# EAGLE schematic Z-_SUN_REV_B (EAGLE 9.6.2)
DESIGNER: Thomas Christison; REV#: B; REVIEWER: ADCS Electrical

## Sheet 1 of 6
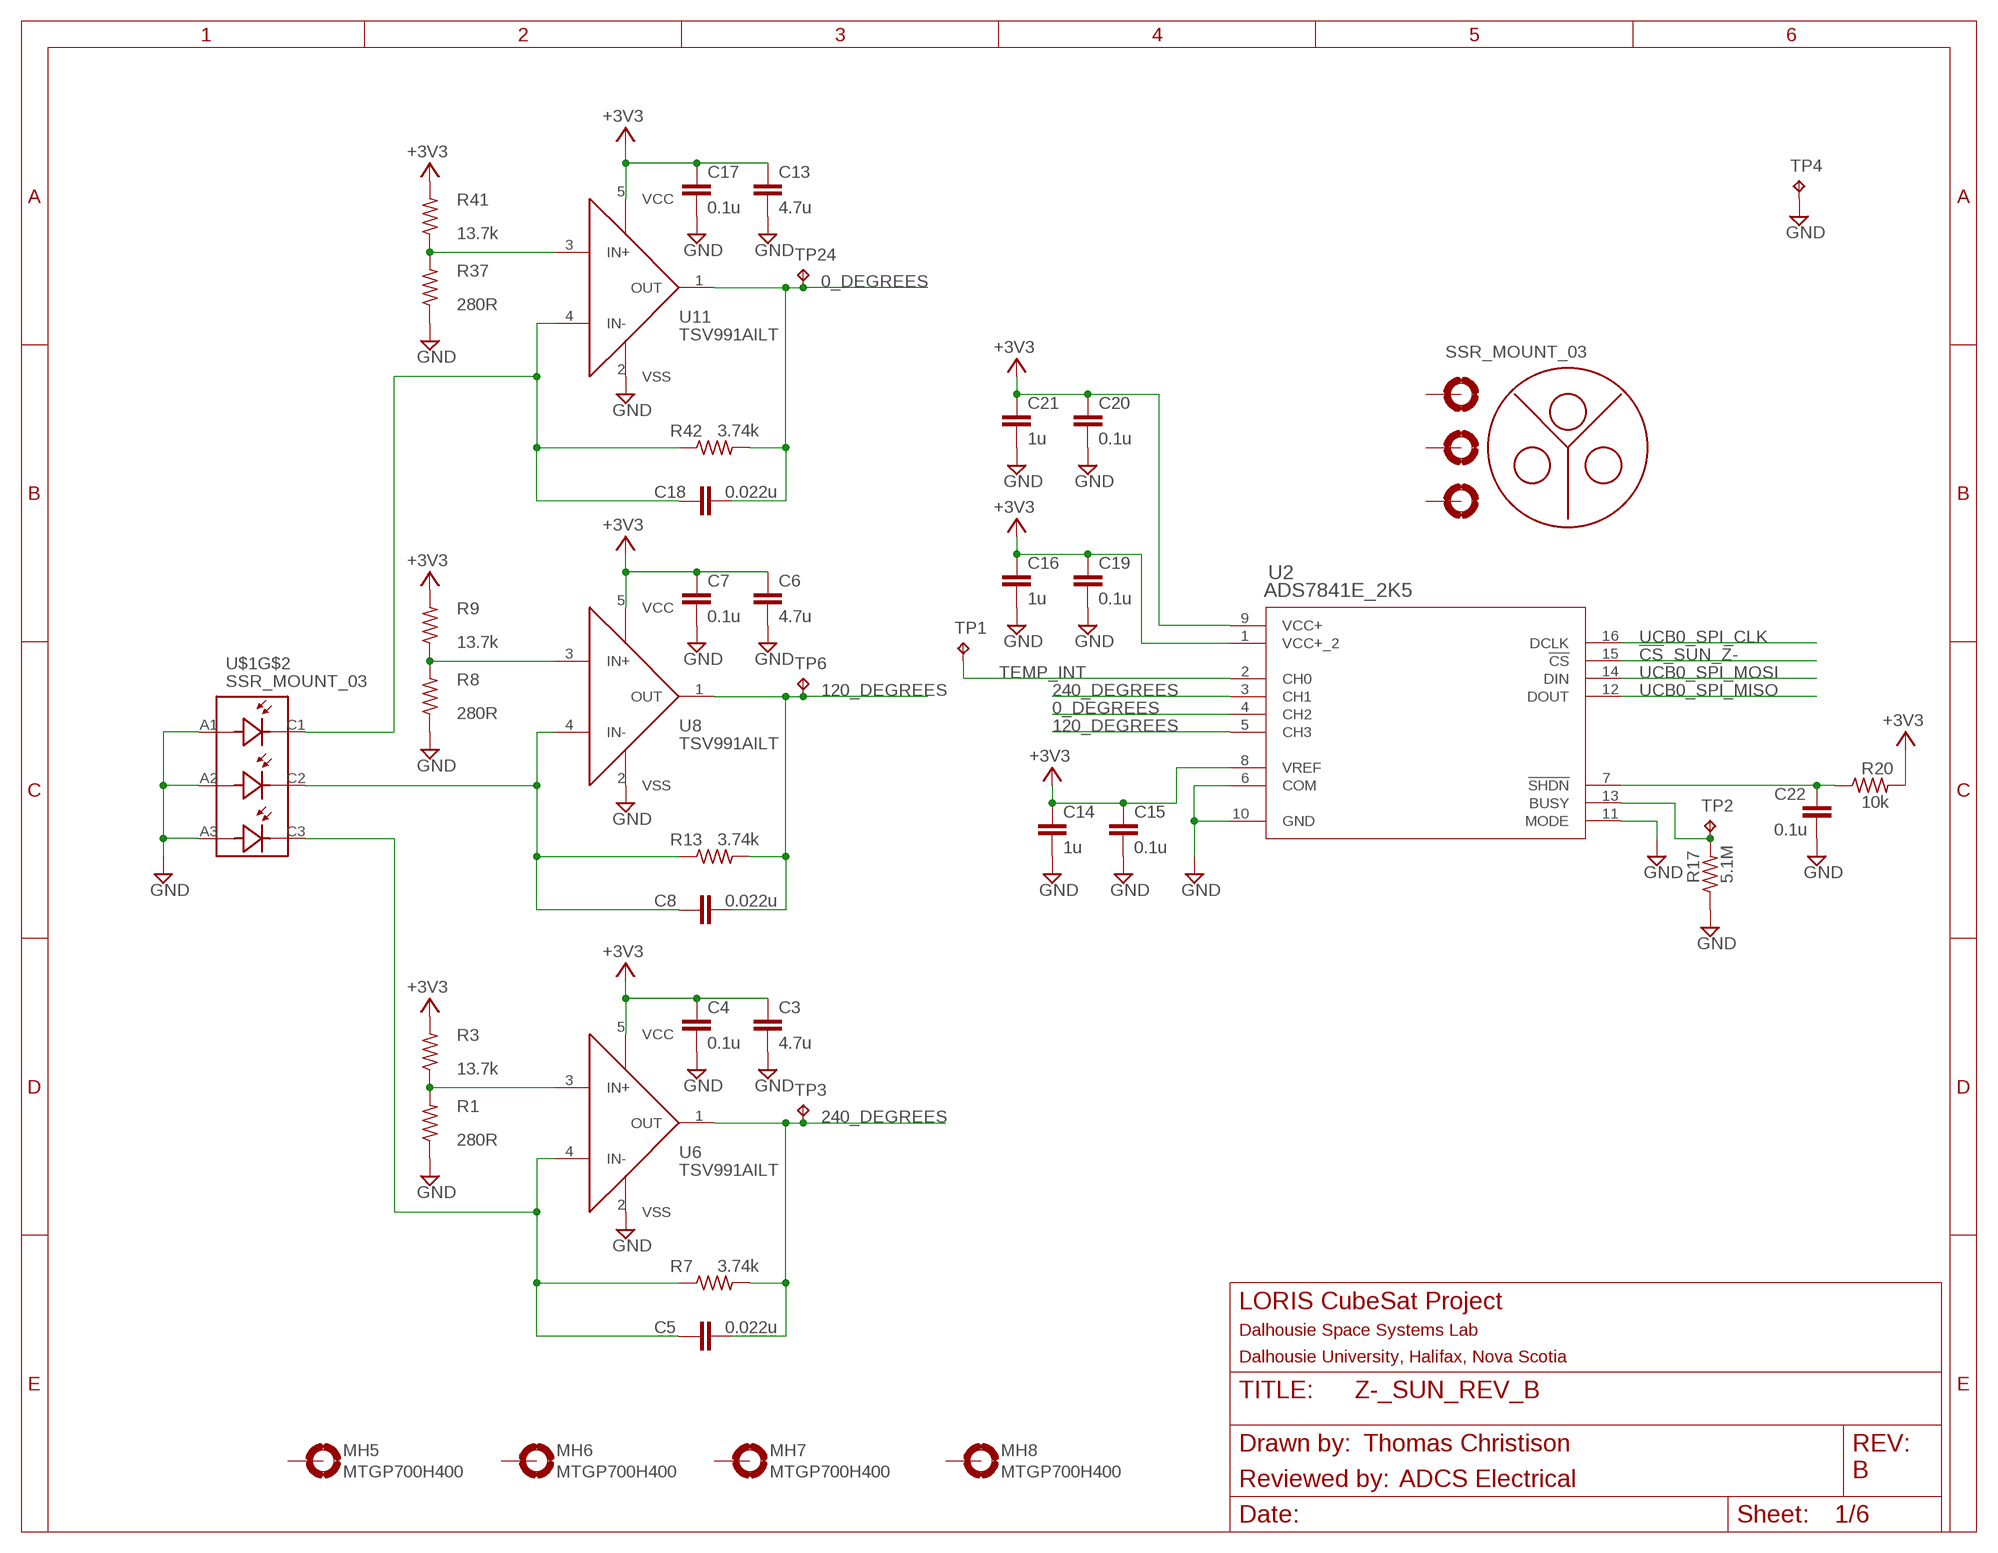
[diagram p0: schematic, sheet 1]

### Parts
C3  4.7u  C-EUC0805  [C0805]
C4  0.1u  C-EUC0402  [C0402]
C5  0.022u  C-EUC0402  [C0402]
C6  4.7u  C-EUC0805  [C0805]
C7  0.1u  C-EUC0402  [C0402]
C8  0.022u  C-EUC0402  [C0402]
C13  4.7u  C-EUC0805  [C0805]
C14  1u  C-EUC0402  [C0402]
C15  0.1u  C-EUC0402  [C0402]
C16  1u  C-EUC0402  [C0402]
C17  0.1u  C-EUC0402  [C0402]
C18  0.022u  C-EUC0402  [C0402]
C19  0.1u  C-EUC0402  [C0402]
C20  0.1u  C-EUC0402  [C0402]
C21  1u  C-EUC0402  [C0402]
C22  0.1u  C-EUC0402  [C0402]
MH5  MTGP700H400  [MTGP700H400]
MH6  MTGP700H400  [MTGP700H400]
MH7  MTGP700H400  [MTGP700H400]
MH8  MTGP700H400  [MTGP700H400]
R1  280R  R-US_R0402  [R0402]
R3  13.7k  R-US_R0402  [R0402]
R7  3.74k  R-US_R0402  [R0402]
R8  280R  R-US_R0402  [R0402]
R9  13.7k  R-US_R0402  [R0402]
R13  3.74k  R-US_R0402  [R0402]
R17  5.1M  R-US_R0402  [R0402]
R20  10k  R-US_R0402  [R0402]
R37  280R  R-US_R0402  [R0402]
R41  13.7k  R-US_R0402  [R0402]
R42  3.74k  R-US_R0402  [R0402]
TP1  TESTPOINT  [TP_P76H50]
TP2  TESTPOINT  [TP_P76H50]
TP3  TESTPOINT  [TP_P76H50]
TP4  TESTPOINT  [TP_P76H50]
TP6  TESTPOINT  [TP_P76H50]
TP24  TESTPOINT  [TP_P76H50]
U2  ADS7841E_2K5  [DBQ16]
U6  TSV991AILT  [SOT95P280X145-5N]
U8  TSV991AILT  [SOT95P280X145-5N]
U11  TSV991AILT  [SOT95P280X145-5N]
U$1  SSR_MOUNT_03  [SSR_MOUNT_03]

### Nets
0_DEGREES: C18.2 R42.2 TP24.1(TP) U2.4(CH2) U11.1(OUT)
120_DEGREES: C8.2 R13.2 TP6.1(TP) U2.5(CH3) U8.1(OUT)
240_DEGREES: C5.2 R7.2 TP3.1(TP) U2.3(CH1) U6.1(OUT)
!CS!_SUN_Z-: U2.15(!CS) ; also sheet 2
+3V3: C3.1 C4.1 C6.1 C7.1 C13.1 C14.1 C15.1 C16.1 C17.1 C19.1 C20.1 C21.1 R3.2 R9.2 R20.2 R41.2 U2.1(VCC+_2) U2.8(VREF) U2.9(VCC+) U6.5(VCC) U8.5(VCC) U11.5(VCC) ; also sheet 2,3,4,5,6
GND: C3.2 C4.2 C6.2 C7.2 C13.2 C14.2 C15.2 C16.2 C17.2 C19.2 C20.2 C21.2 C22.2 R1.1 R8.1 R17.1 R37.1 TP4.1(TP) U2.6(COM) U2.10(GND) U2.11(MODE) U6.2(VSS) U8.2(VSS) U11.2(VSS) U$1.A1 U$1.A2 U$1.A3 ; also sheet 2,3,4,5,6
N$2: R17.2 TP2.1(TP) U2.13(BUSY)
N$8: R1.2 R3.1 U6.3(IN+)
N$12: C5.1 R7.1 U6.4(IN-) U$1.C3
N$15: C22.1 R20.1 U2.7(!SHDN)
N$27: C8.1 R13.1 U8.4(IN-) U$1.C2
N$28: R8.2 R9.1 U8.3(IN+)
N$42: C18.1 R42.1 U11.4(IN-) U$1.C1
N$43: R37.2 R41.1 U11.3(IN+)
TEMP_INT: TP1.1(TP) U2.2(CH0) ; also sheet 2
UCB0_SPI_CLK: U2.16(DCLK) ; also sheet 2,3,4,5,6
UCB0_SPI_MISO: U2.12(DOUT) ; also sheet 2,3,4,5,6
UCB0_SPI_MOSI: U2.14(DIN) ; also sheet 2,3,4,5,6
Unconnected: MH5.1(MOUNT) MH6.1(MOUNT) MH7.1(MOUNT) MH8.1(MOUNT) U$1.1(MOUNT) U$1.2(MOUNT1) U$1.3(MOUNT2)

### Notes on the sheet
- Thomas Christison
- B
- ADCS Electrical

## Sheet 2 of 6
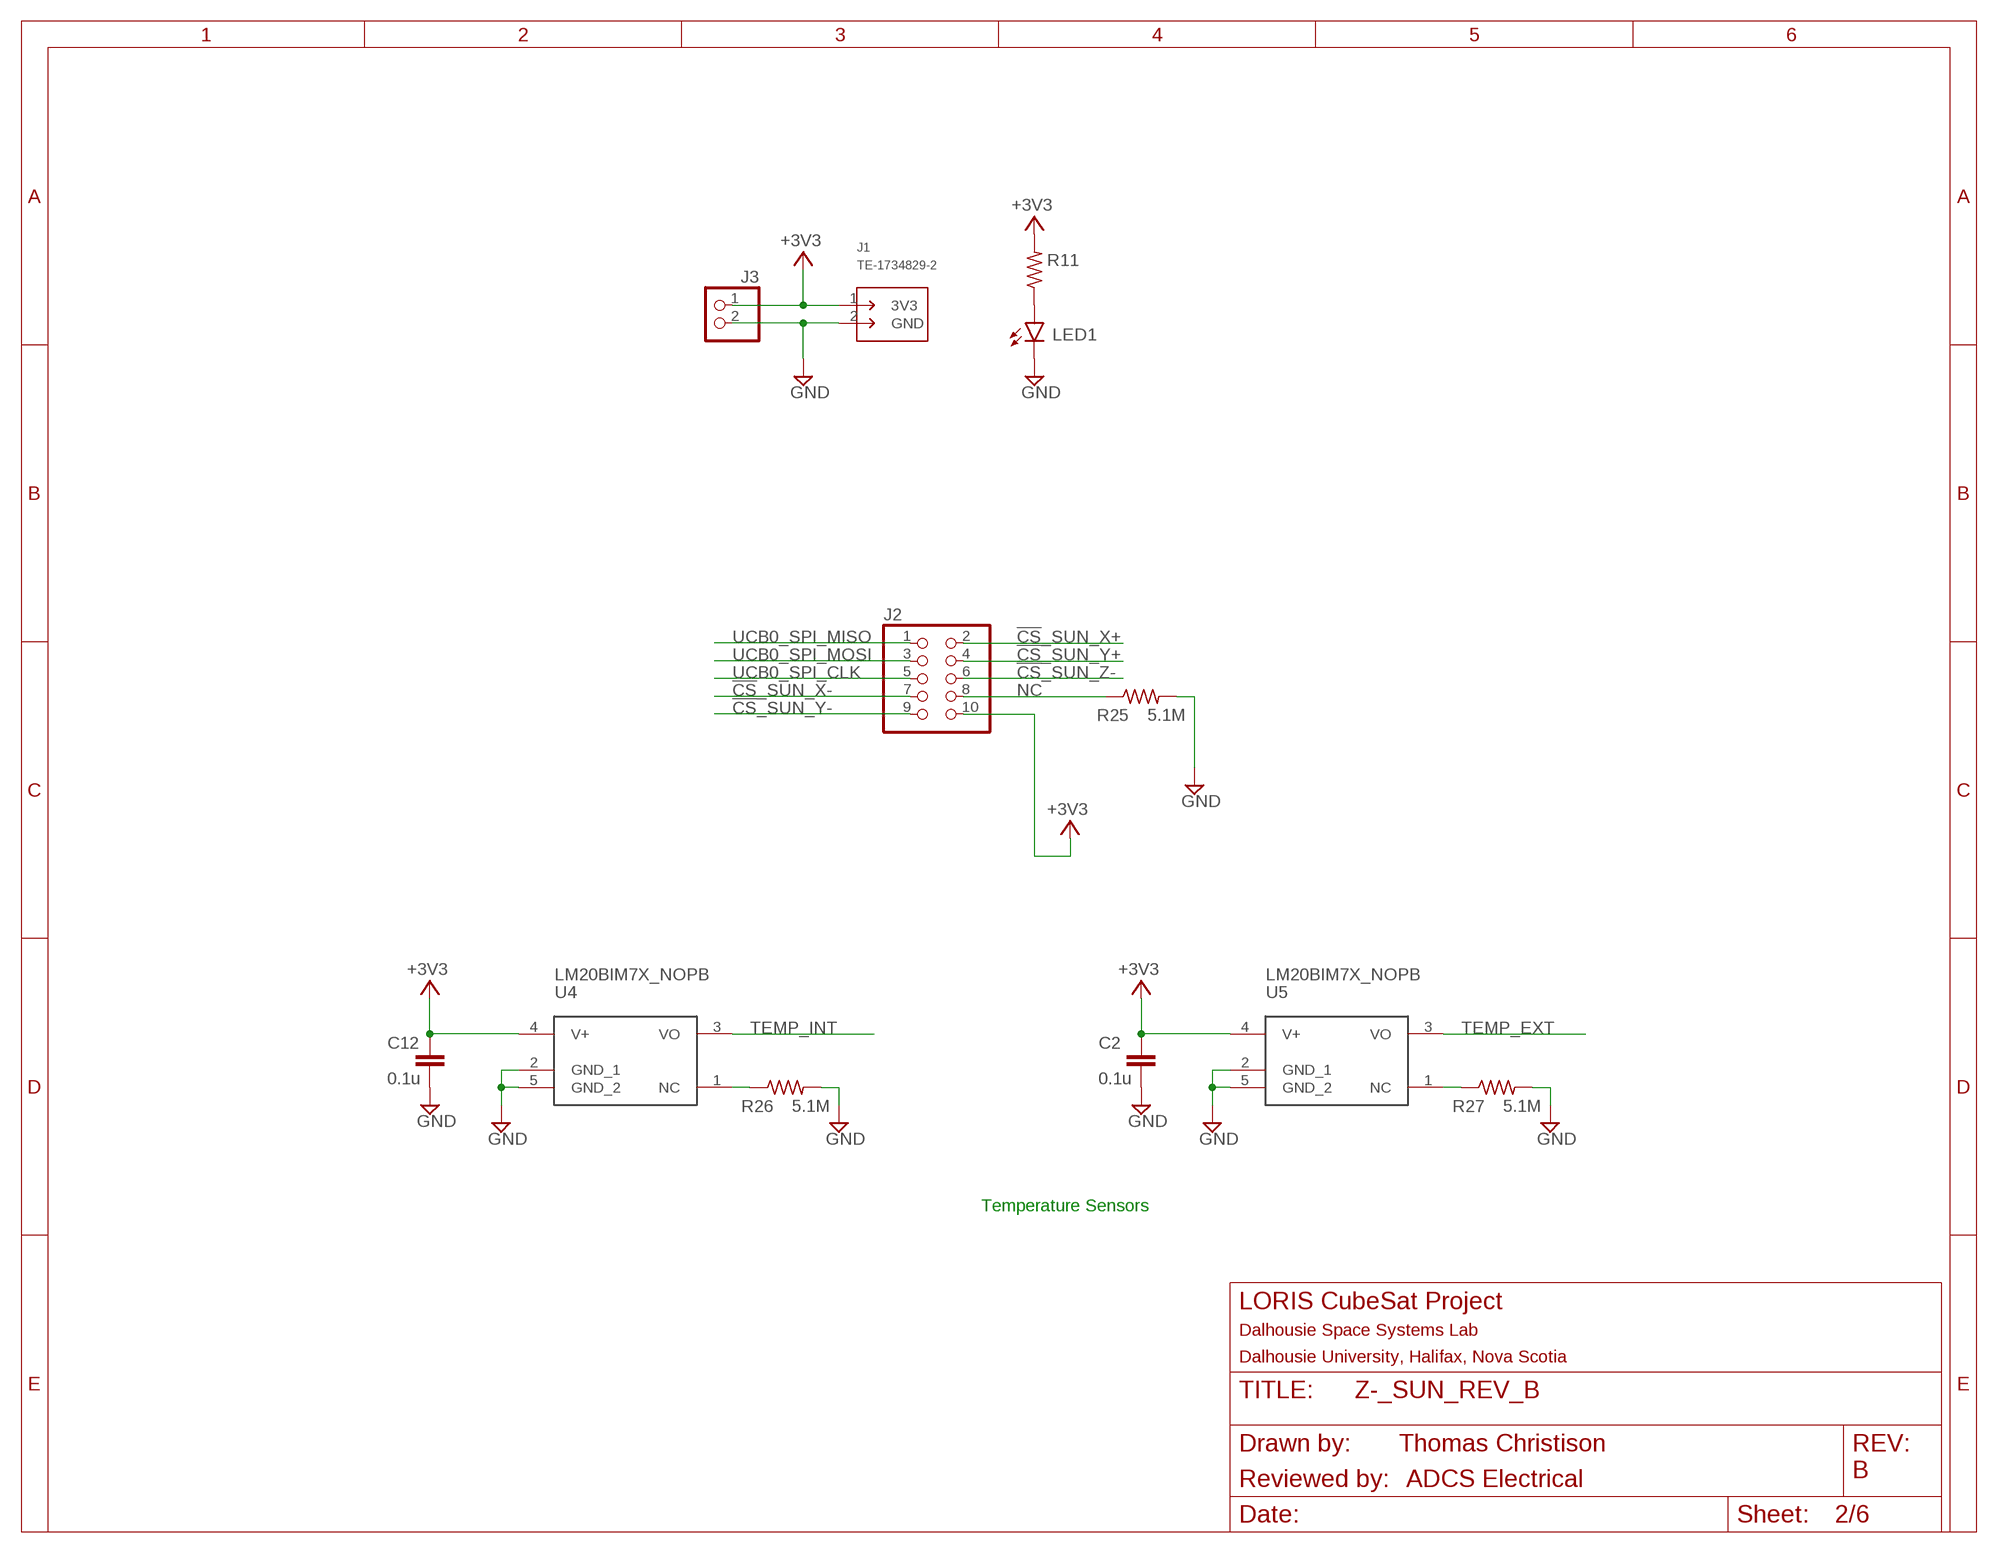
[diagram p1: schematic, sheet 2]

### Parts
C2  0.1u  C-EUC0402  [C0402]
C12  0.1u  C-EUC0402  [C0402]
J1  TE-1734829-2  [TE-1734829-2]
J2  PINHD-2X5_MTG_HOLES  [2X05]
J3  HDR_1X2_  [1X02]
LED1  LEDCHIP-LED0603  [CHIP-LED0603]
R11  R-US_R0603  [R0603]
R25  5.1M  R-US_R0402  [R0402]
R26  5.1M  R-US_R0402  [R0402]
R27  5.1M  R-US_R0402  [R0402]
U4  LM20BIM7X_NOPB  [SOT23-5P65_210X110L40X22N_LM20]
U5  LM20BIM7X_NOPB  [SOT23-5P65_210X110L40X22N_LM20]

### Nets
!CS!_SUN_X+: J2.2 ; also sheet 3
!CS!_SUN_X-: J2.7 ; also sheet 4
!CS!_SUN_Y+: J2.4 ; also sheet 5
!CS!_SUN_Y-: J2.9 ; also sheet 6
!CS!_SUN_Z-: J2.6 ; also sheet 1
+3V3: C2.1 C12.1 J1.1(3V3) J2.10 J3.1 R11.2 U4.4(V+) U5.4(V+) ; also sheet 1,3,4,5,6
GND: C2.2 C12.2 J1.2(GND) J3.2 LED1.C R25.2 R26.2 R27.2 U4.2(GND_1) U4.5(GND_2) U5.2(GND_1) U5.5(GND_2) ; also sheet 1,3,4,5,6
N$7: R26.1 U4.1(NC)
N$20: R27.1 U5.1(NC)
N$21: LED1.A R11.1
N$67: J2.8 R25.1
TEMP_EXT: U5.3(VO) ; also sheet 3
TEMP_INT: U4.3(VO) ; also sheet 1
UCB0_SPI_CLK: J2.5 ; also sheet 1,3,4,5,6
UCB0_SPI_MISO: J2.1 ; also sheet 1,3,4,5,6
UCB0_SPI_MOSI: J2.3 ; also sheet 1,3,4,5,6

### Notes on the sheet
- NC
- Temperature Sensors
- ADCS Electrical

## Sheet 3 of 6
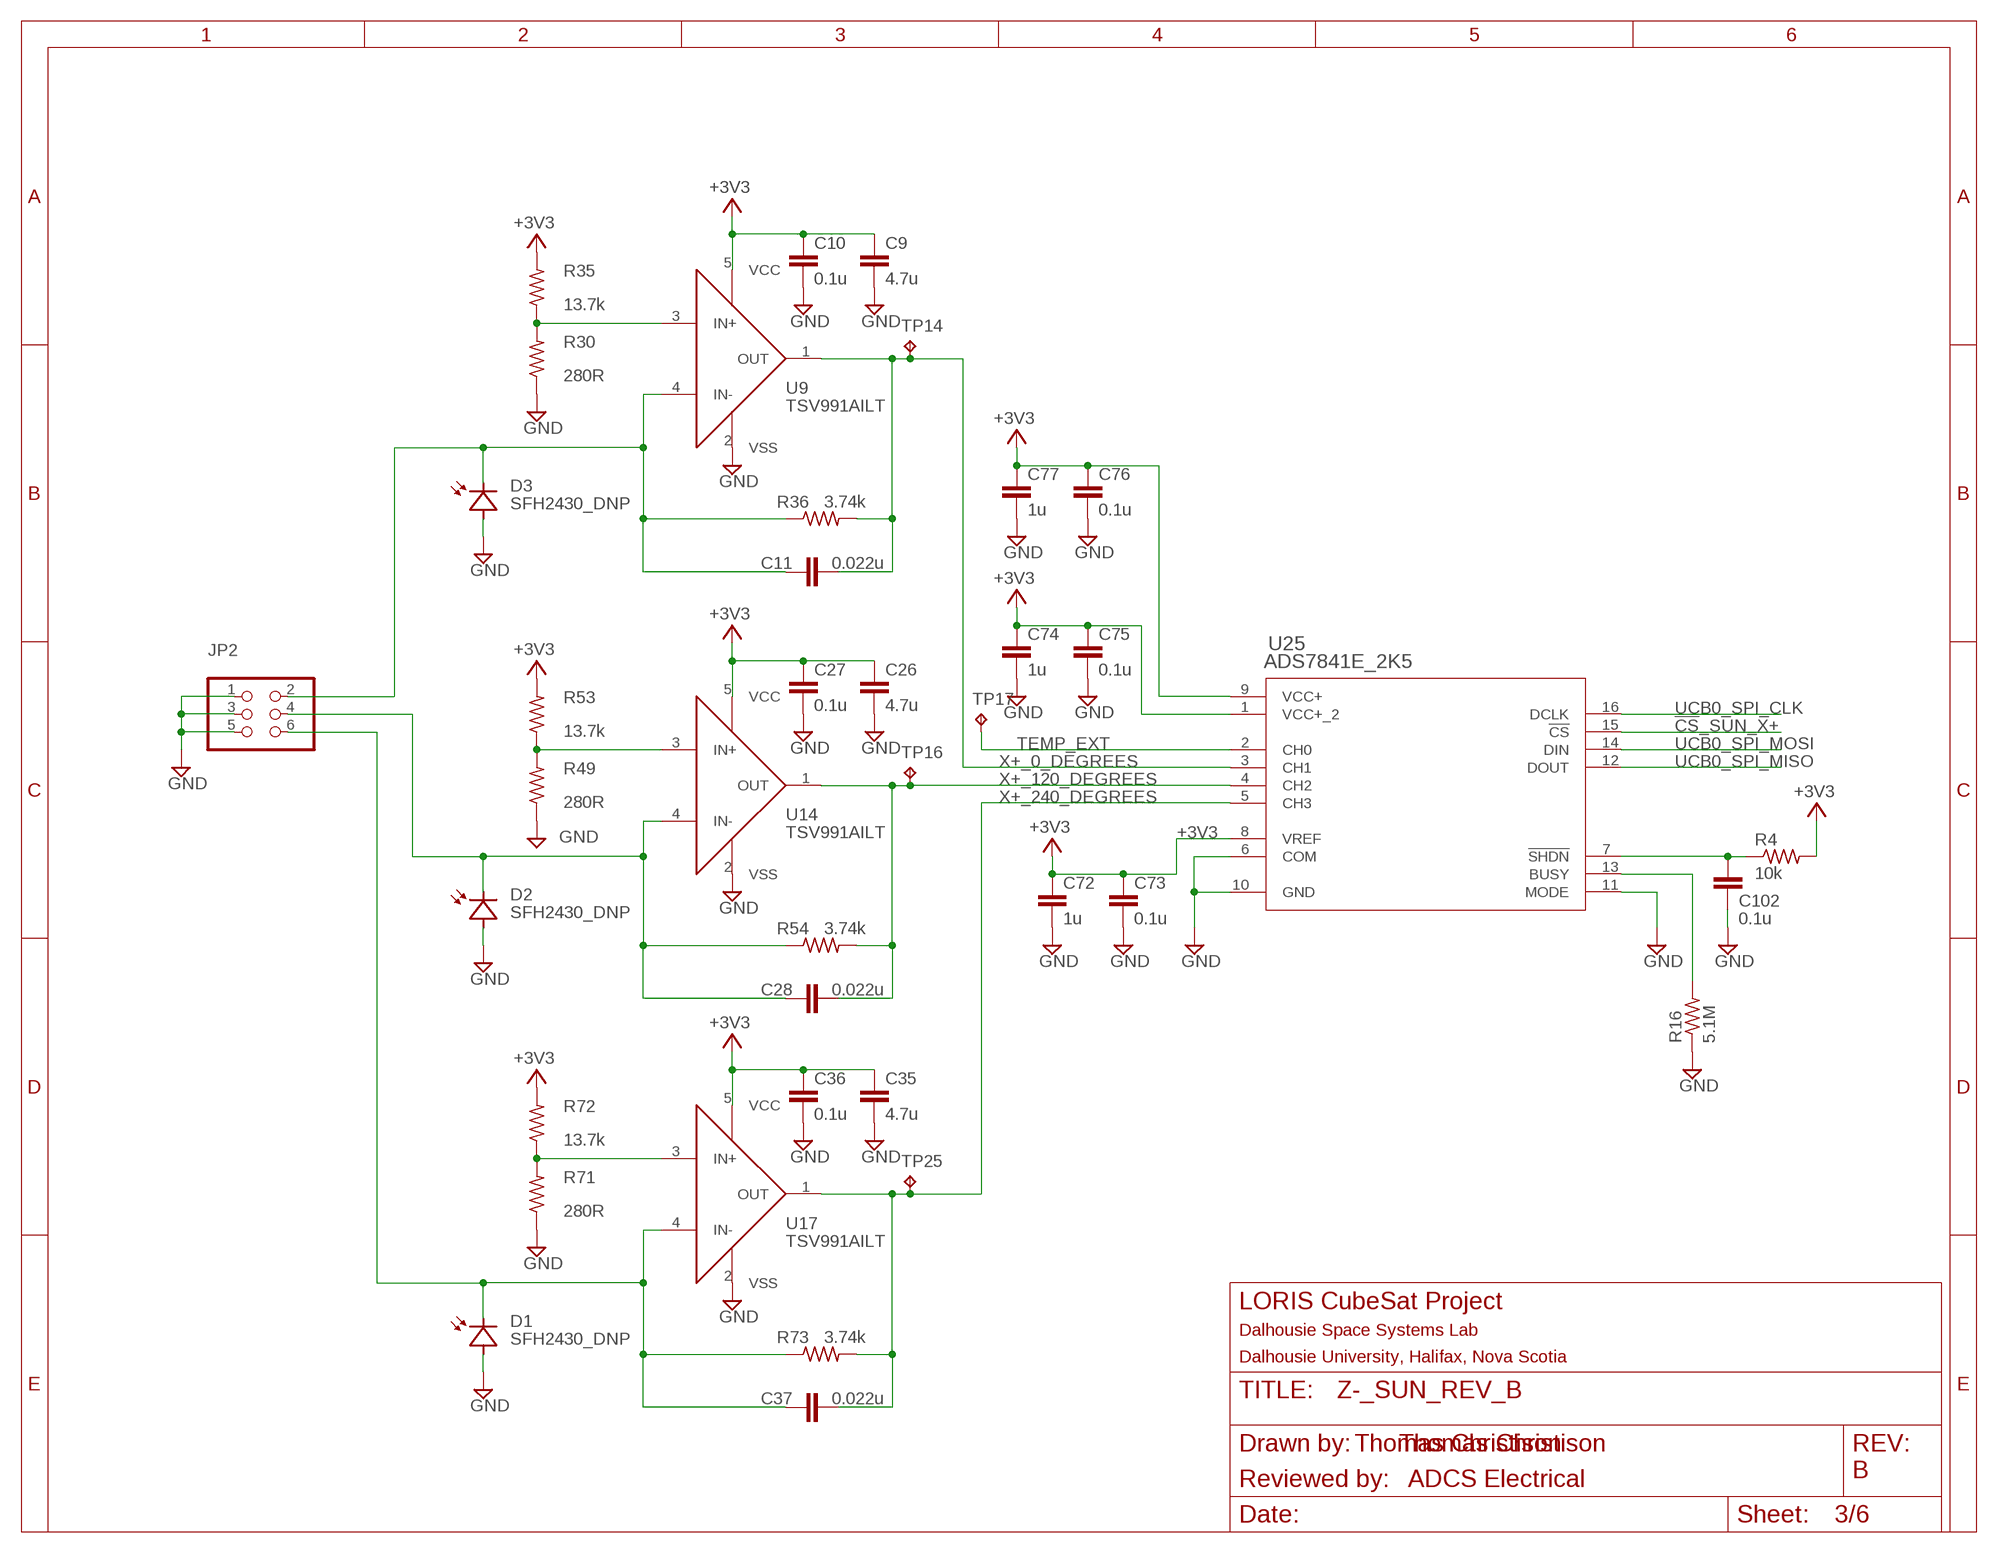
[diagram p2: schematic, sheet 3]

### Parts
C9  4.7u  C-EUC0805  [C0805]
C10  0.1u  C-EUC0402  [C0402]
C11  0.022u  C-EUC0402  [C0402]
C26  4.7u  C-EUC0805  [C0805]
C27  0.1u  C-EUC0402  [C0402]
C28  0.022u  C-EUC0402  [C0402]
C35  4.7u  C-EUC0805  [C0805]
C36  0.1u  C-EUC0402  [C0402]
C37  0.022u  C-EUC0402  [C0402]
C72  1u  C-EUC0402  [C0402]
C73  0.1u  C-EUC0402  [C0402]
C74  1u  C-EUC0402  [C0402]
C75  0.1u  C-EUC0402  [C0402]
C76  0.1u  C-EUC0402  [C0402]
C77  1u  C-EUC0402  [C0402]
C102  0.1u  C-EUC0402  [C0402]
JP2  PINHD-2X3_MTG_HOLESHOLES  [2X03_MTG_HOLES]
R4  10k  R-US_R0402  [R0402]
R16  5.1M  R-US_R0402  [R0402]
R30  280R  R-US_R0402  [R0402]
R35  13.7k  R-US_R0402  [R0402]
R36  3.74k  R-US_R0402  [R0402]
R49  280R  R-US_R0402  [R0402]
R53  13.7k  R-US_R0402  [R0402]
R54  3.74k  R-US_R0402  [R0402]
R71  280R  R-US_R0402  [R0402]
R72  13.7k  R-US_R0402  [R0402]
R73  3.74k  R-US_R0402  [R0402]
TP14  TESTPOINT  [TP_P76H50]
TP16  TESTPOINT  [TP_P76H50]
TP17  TESTPOINT  [TP_P76H50]
TP25  TESTPOINT  [TP_P76H50]
U9  TSV991AILT  [SOT95P280X145-5N]
U14  TSV991AILT  [SOT95P280X145-5N]
U17  TSV991AILT  [SOT95P280X145-5N]
U25  ADS7841E_2K5  [DBQ16]

### Nets
!CS!_SUN_X+: U25.15(!CS) ; also sheet 2
+3V3: C9.1 C10.1 C26.1 C27.1 C35.1 C36.1 C72.1 C73.1 C74.1 C75.1 C76.1 C77.1 R4.2 R35.2 R53.2 R72.2 U9.5(VCC) U14.5(VCC) U17.5(VCC) U25.1(VCC+_2) U25.8(VREF) U25.9(VCC+) ; also sheet 1,2,4,5,6
GND: C9.2 C10.2 C26.2 C27.2 C35.2 C36.2 C72.2 C73.2 C74.2 C75.2 C76.2 C77.2 C102.2 JP2.1 JP2.3 JP2.5 R16.1 R30.1 R49.1 R71.1 U9.2(VSS) U14.2(VSS) U17.2(VSS) U25.6(COM) U25.10(GND) U25.11(MODE) ; also sheet 1,2,4,5,6
N$4: C102.1 R4.1 U25.7(!SHDN)
N$40: R30.2 R35.1 U9.3(IN+)
N$49: C11.1 JP2.2 R36.1 U9.4(IN-)
N$51: R16.2 U25.13(BUSY)
N$55: C28.1 JP2.4 R54.1 U14.4(IN-)
N$57: C37.1 JP2.6 R73.1 U17.4(IN-)
N$60: R49.2 R53.1 U14.3(IN+)
N$71: R71.2 R72.1 U17.3(IN+)
TEMP_EXT: TP17.1(TP) U25.2(CH0) ; also sheet 2
UCB0_SPI_CLK: U25.16(DCLK) ; also sheet 1,2,4,5,6
UCB0_SPI_MISO: U25.12(DOUT) ; also sheet 1,2,4,5,6
UCB0_SPI_MOSI: U25.14(DIN) ; also sheet 1,2,4,5,6
X+_0_DEGREES: C11.2 R36.2 TP14.1(TP) U9.1(OUT) U25.3(CH1)
X+_120_DEGREES: C28.2 R54.2 TP16.1(TP) U14.1(OUT) U25.4(CH2)
X+_240_DEGREES: C37.2 R73.2 TP25.1(TP) U17.1(OUT) U25.5(CH3)

### Notes on the sheet
- Thomas Christison
- B
- ADCS Electrical

## Sheet 4 of 6
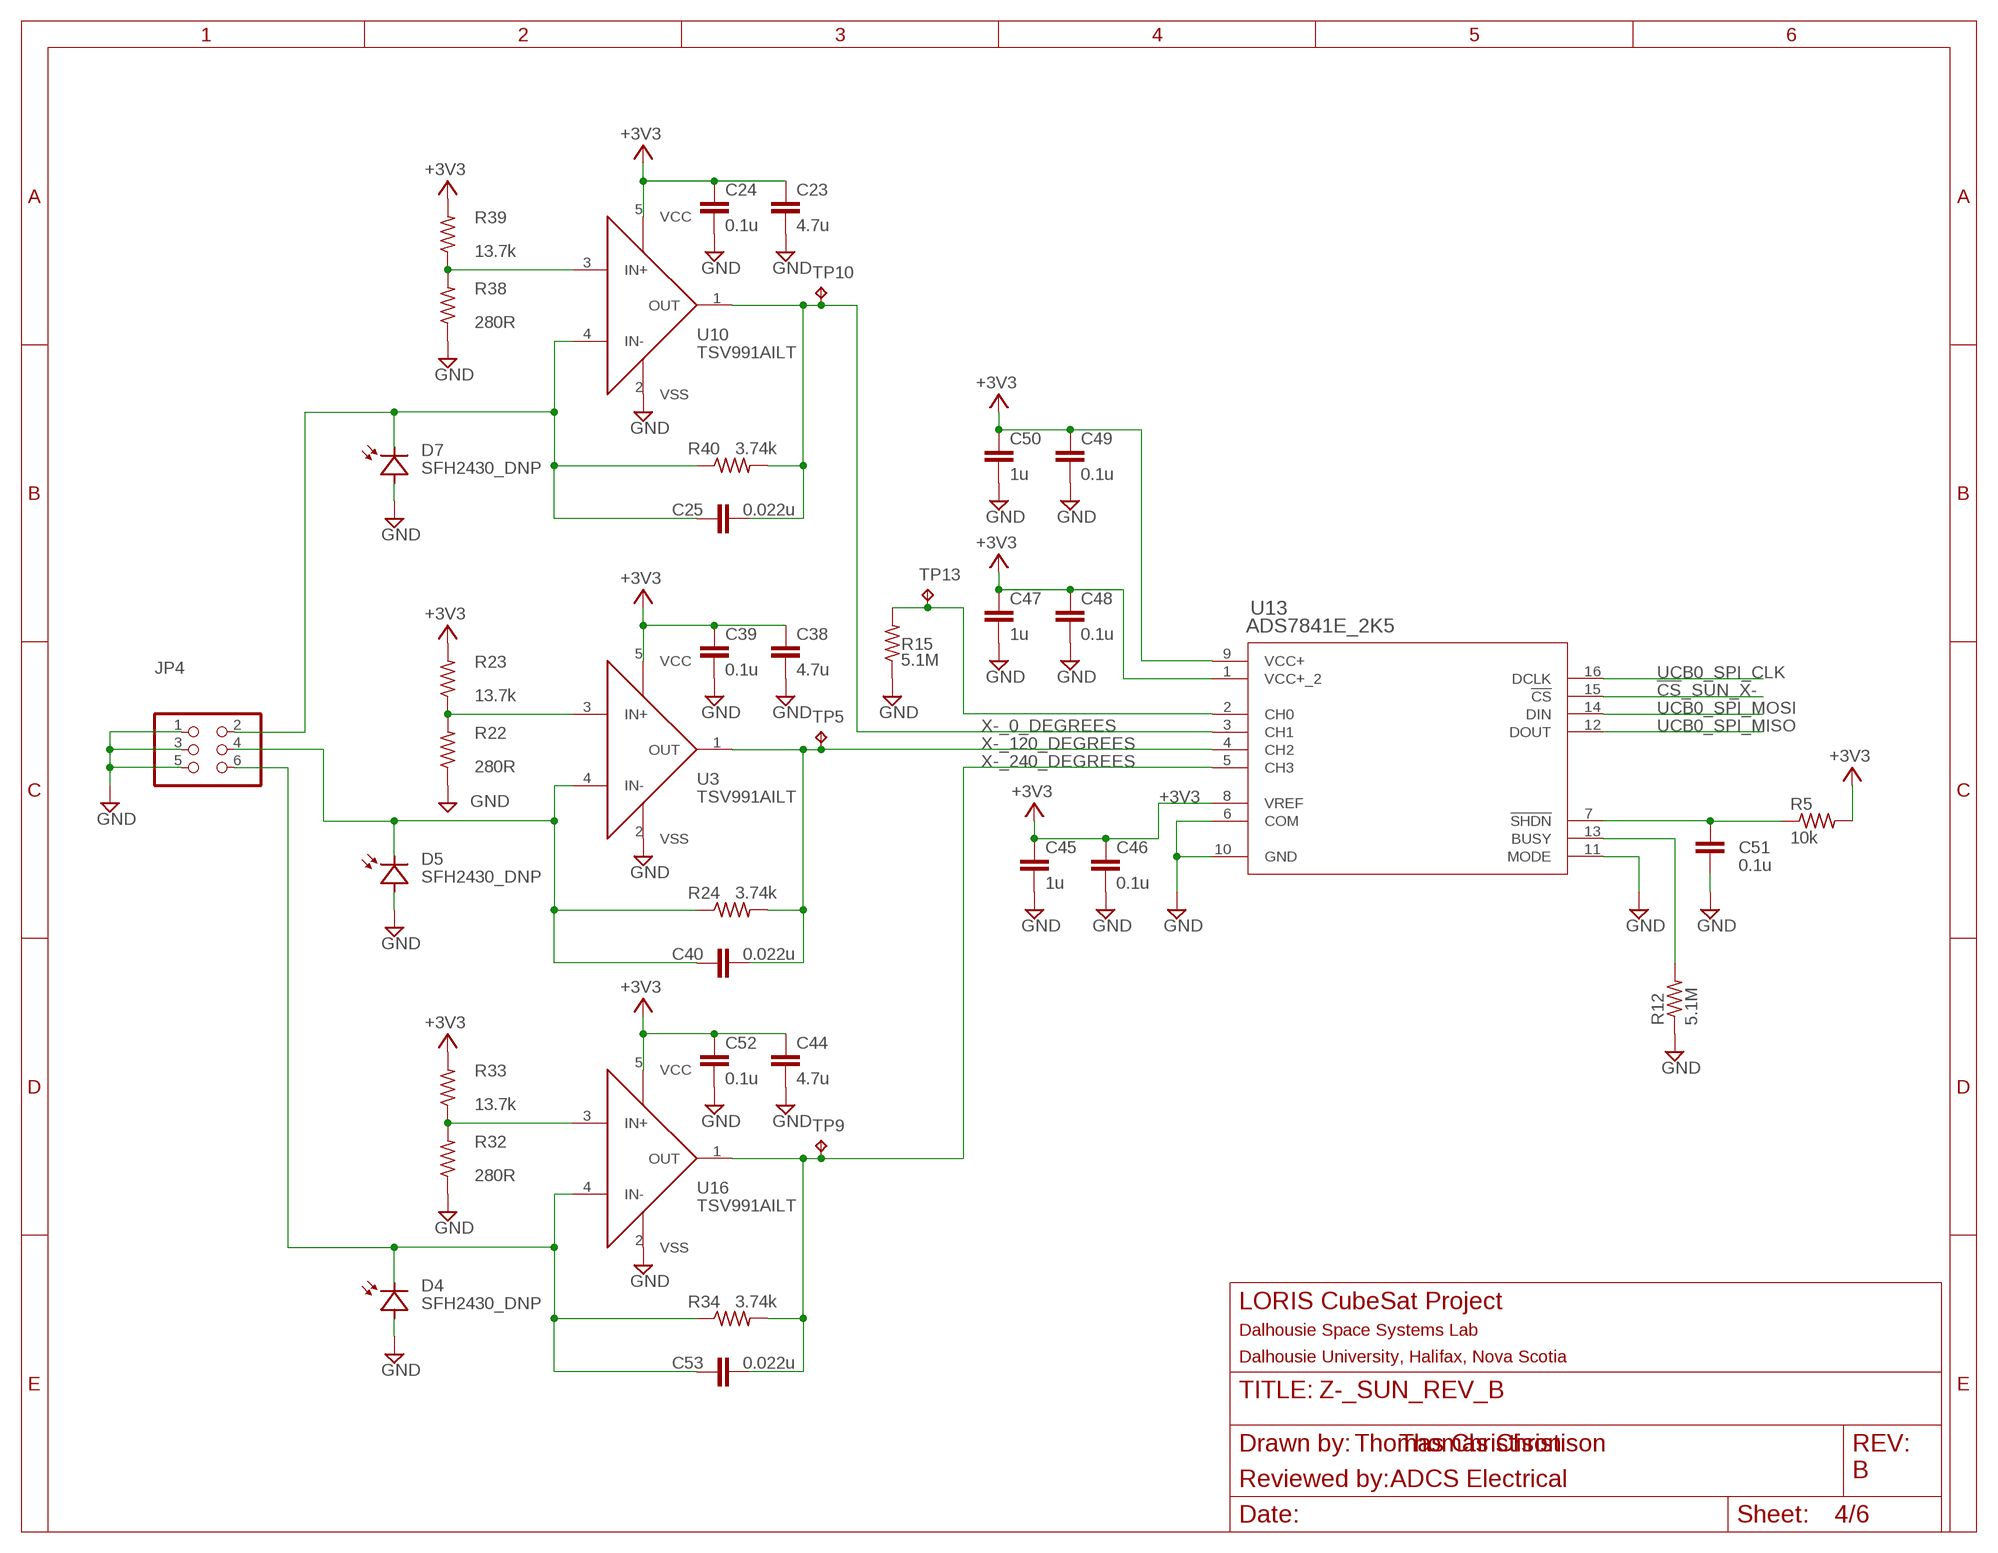
[diagram p3: schematic, sheet 4]

### Parts
C23  4.7u  C-EUC0805  [C0805]
C24  0.1u  C-EUC0402  [C0402]
C25  0.022u  C-EUC0402  [C0402]
C38  4.7u  C-EUC0805  [C0805]
C39  0.1u  C-EUC0402  [C0402]
C40  0.022u  C-EUC0402  [C0402]
C44  4.7u  C-EUC0805  [C0805]
C45  1u  C-EUC0402  [C0402]
C46  0.1u  C-EUC0402  [C0402]
C47  1u  C-EUC0402  [C0402]
C48  0.1u  C-EUC0402  [C0402]
C49  0.1u  C-EUC0402  [C0402]
C50  1u  C-EUC0402  [C0402]
C51  0.1u  C-EUC0402  [C0402]
C52  0.1u  C-EUC0402  [C0402]
C53  0.022u  C-EUC0402  [C0402]
JP4  PINHD-2X3_MTG_HOLESHOLES  [2X03_MTG_HOLES]
R5  10k  R-US_R0402  [R0402]
R12  5.1M  R-US_R0402  [R0402]
R15  5.1M  R-US_R0402  [R0402]
R22  280R  R-US_R0402  [R0402]
R23  13.7k  R-US_R0402  [R0402]
R24  3.74k  R-US_R0402  [R0402]
R32  280R  R-US_R0402  [R0402]
R33  13.7k  R-US_R0402  [R0402]
R34  3.74k  R-US_R0402  [R0402]
R38  280R  R-US_R0402  [R0402]
R39  13.7k  R-US_R0402  [R0402]
R40  3.74k  R-US_R0402  [R0402]
TP5  TESTPOINT  [TP_P76H50]
TP9  TESTPOINT  [TP_P76H50]
TP10  TESTPOINT  [TP_P76H50]
TP13  TESTPOINT  [TP_P76H50]
U3  TSV991AILT  [SOT95P280X145-5N]
U10  TSV991AILT  [SOT95P280X145-5N]
U13  ADS7841E_2K5  [DBQ16]
U16  TSV991AILT  [SOT95P280X145-5N]

### Nets
!CS!_SUN_X-: U13.15(!CS) ; also sheet 2
+3V3: C23.1 C24.1 C38.1 C39.1 C44.1 C45.1 C46.1 C47.1 C48.1 C49.1 C50.1 C52.1 R5.2 R23.2 R33.2 R39.2 U3.5(VCC) U10.5(VCC) U13.1(VCC+_2) U13.8(VREF) U13.9(VCC+) U16.5(VCC) ; also sheet 1,2,3,5,6
GND: C23.2 C24.2 C38.2 C39.2 C44.2 C45.2 C46.2 C47.2 C48.2 C49.2 C50.2 C51.2 C52.2 JP4.1 JP4.3 JP4.5 R12.1 R15.1 R22.1 R32.1 R38.1 U3.2(VSS) U10.2(VSS) U13.6(COM) U13.10(GND) U13.11(MODE) U16.2(VSS) ; also sheet 1,2,3,5,6
N$6: R38.2 R39.1 U10.3(IN+)
N$10: R15.2 TP13.1(TP) U13.2(CH0)
N$22: C51.1 R5.1 U13.7(!SHDN)
N$32: R22.2 R23.1 U3.3(IN+)
N$38: C25.1 JP4.2 R40.1 U10.4(IN-)
N$41: R32.2 R33.1 U16.3(IN+)
N$44: C40.1 JP4.4 R24.1 U3.4(IN-)
N$46: C53.1 JP4.6 R34.1 U16.4(IN-)
N$50: R12.2 U13.13(BUSY)
UCB0_SPI_CLK: U13.16(DCLK) ; also sheet 1,2,3,5,6
UCB0_SPI_MISO: U13.12(DOUT) ; also sheet 1,2,3,5,6
UCB0_SPI_MOSI: U13.14(DIN) ; also sheet 1,2,3,5,6
X-_0_DEGREES: C25.2 R40.2 TP10.1(TP) U10.1(OUT) U13.3(CH1)
X-_120_DEGREES: C40.2 R24.2 TP5.1(TP) U3.1(OUT) U13.4(CH2)
X-_240_DEGREES: C53.2 R34.2 TP9.1(TP) U13.5(CH3) U16.1(OUT)

### Notes on the sheet
- Thomas Christison
- B
- ADCS Electrical

## Sheet 5 of 6
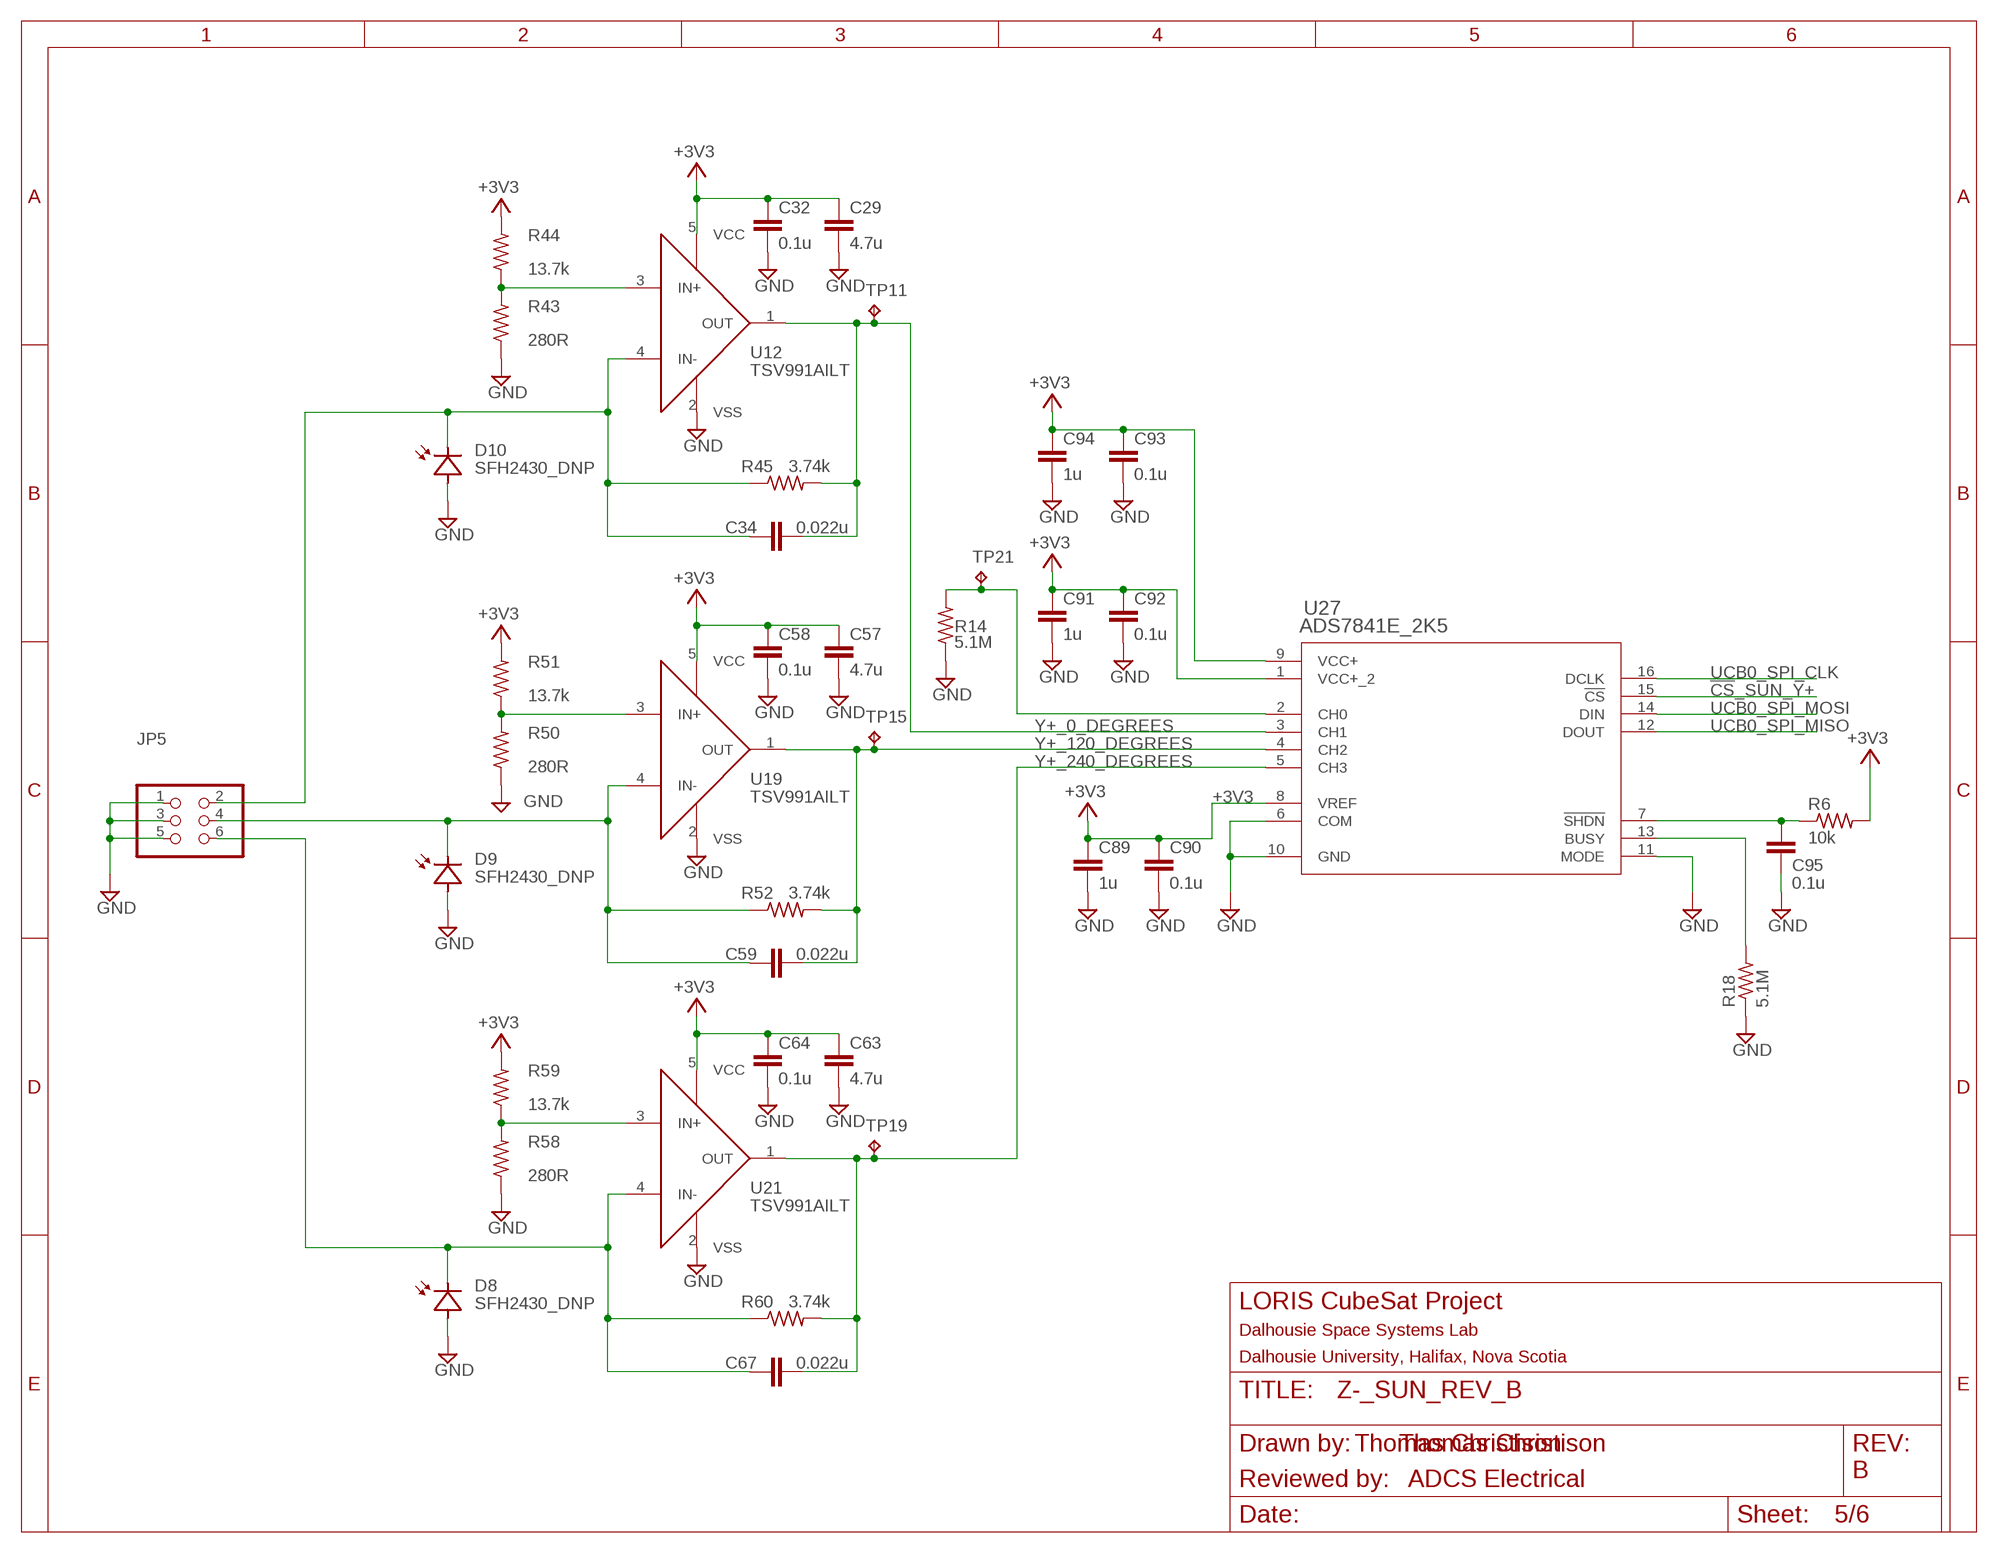
[diagram p4: schematic, sheet 5]

### Parts
C29  4.7u  C-EUC0805  [C0805]
C32  0.1u  C-EUC0402  [C0402]
C34  0.022u  C-EUC0402  [C0402]
C57  4.7u  C-EUC0805  [C0805]
C58  0.1u  C-EUC0402  [C0402]
C59  0.022u  C-EUC0402  [C0402]
C63  4.7u  C-EUC0805  [C0805]
C64  0.1u  C-EUC0402  [C0402]
C67  0.022u  C-EUC0402  [C0402]
C89  1u  C-EUC0402  [C0402]
C90  0.1u  C-EUC0402  [C0402]
C91  1u  C-EUC0402  [C0402]
C92  0.1u  C-EUC0402  [C0402]
C93  0.1u  C-EUC0402  [C0402]
C94  1u  C-EUC0402  [C0402]
C95  0.1u  C-EUC0402  [C0402]
JP5  PINHD-2X3_MTG_HOLESHOLES  [2X03_MTG_HOLES]
R6  10k  R-US_R0402  [R0402]
R14  5.1M  R-US_R0402  [R0402]
R18  5.1M  R-US_R0402  [R0402]
R43  280R  R-US_R0402  [R0402]
R44  13.7k  R-US_R0402  [R0402]
R45  3.74k  R-US_R0402  [R0402]
R50  280R  R-US_R0402  [R0402]
R51  13.7k  R-US_R0402  [R0402]
R52  3.74k  R-US_R0402  [R0402]
R58  280R  R-US_R0402  [R0402]
R59  13.7k  R-US_R0402  [R0402]
R60  3.74k  R-US_R0402  [R0402]
TP11  TESTPOINT  [TP_P76H50]
TP15  TESTPOINT  [TP_P76H50]
TP19  TESTPOINT  [TP_P76H50]
TP21  TESTPOINT  [TP_P76H50]
U12  TSV991AILT  [SOT95P280X145-5N]
U19  TSV991AILT  [SOT95P280X145-5N]
U21  TSV991AILT  [SOT95P280X145-5N]
U27  ADS7841E_2K5  [DBQ16]

### Nets
!CS!_SUN_Y+: U27.15(!CS) ; also sheet 2
+3V3: C29.1 C32.1 C57.1 C58.1 C63.1 C64.1 C89.1 C90.1 C91.1 C92.1 C93.1 C94.1 R6.2 R44.2 R51.2 R59.2 U12.5(VCC) U19.5(VCC) U21.5(VCC) U27.1(VCC+_2) U27.8(VREF) U27.9(VCC+) ; also sheet 1,2,3,4,6
GND: C29.2 C32.2 C57.2 C58.2 C63.2 C64.2 C89.2 C90.2 C91.2 C92.2 C93.2 C94.2 C95.2 JP5.1 JP5.3 JP5.5 R14.1 R18.1 R43.1 R50.1 R58.1 U12.2(VSS) U19.2(VSS) U21.2(VSS) U27.6(COM) U27.10(GND) U27.11(MODE) ; also sheet 1,2,3,4,6
N$11: R14.2 TP21.1(TP) U27.2(CH0)
N$25: C95.1 R6.1 U27.7(!SHDN)
N$30: R43.2 R44.1 U12.3(IN+)
N$37: C34.1 JP5.2 R45.1 U12.4(IN-)
N$52: R18.2 U27.13(BUSY)
N$54: R50.2 R51.1 U19.3(IN+)
N$61: R58.2 R59.1 U21.3(IN+)
N$63: C59.1 JP5.4 R52.1 U19.4(IN-)
N$65: C67.1 JP5.6 R60.1 U21.4(IN-)
UCB0_SPI_CLK: U27.16(DCLK) ; also sheet 1,2,3,4,6
UCB0_SPI_MISO: U27.12(DOUT) ; also sheet 1,2,3,4,6
UCB0_SPI_MOSI: U27.14(DIN) ; also sheet 1,2,3,4,6
Y+_0_DEGREES: C34.2 R45.2 TP11.1(TP) U12.1(OUT) U27.3(CH1)
Y+_120_DEGREES: C59.2 R52.2 TP15.1(TP) U19.1(OUT) U27.4(CH2)
Y+_240_DEGREES: C67.2 R60.2 TP19.1(TP) U21.1(OUT) U27.5(CH3)

### Notes on the sheet
- Thomas Christison
- B
- ADCS Electrical

## Sheet 6 of 6
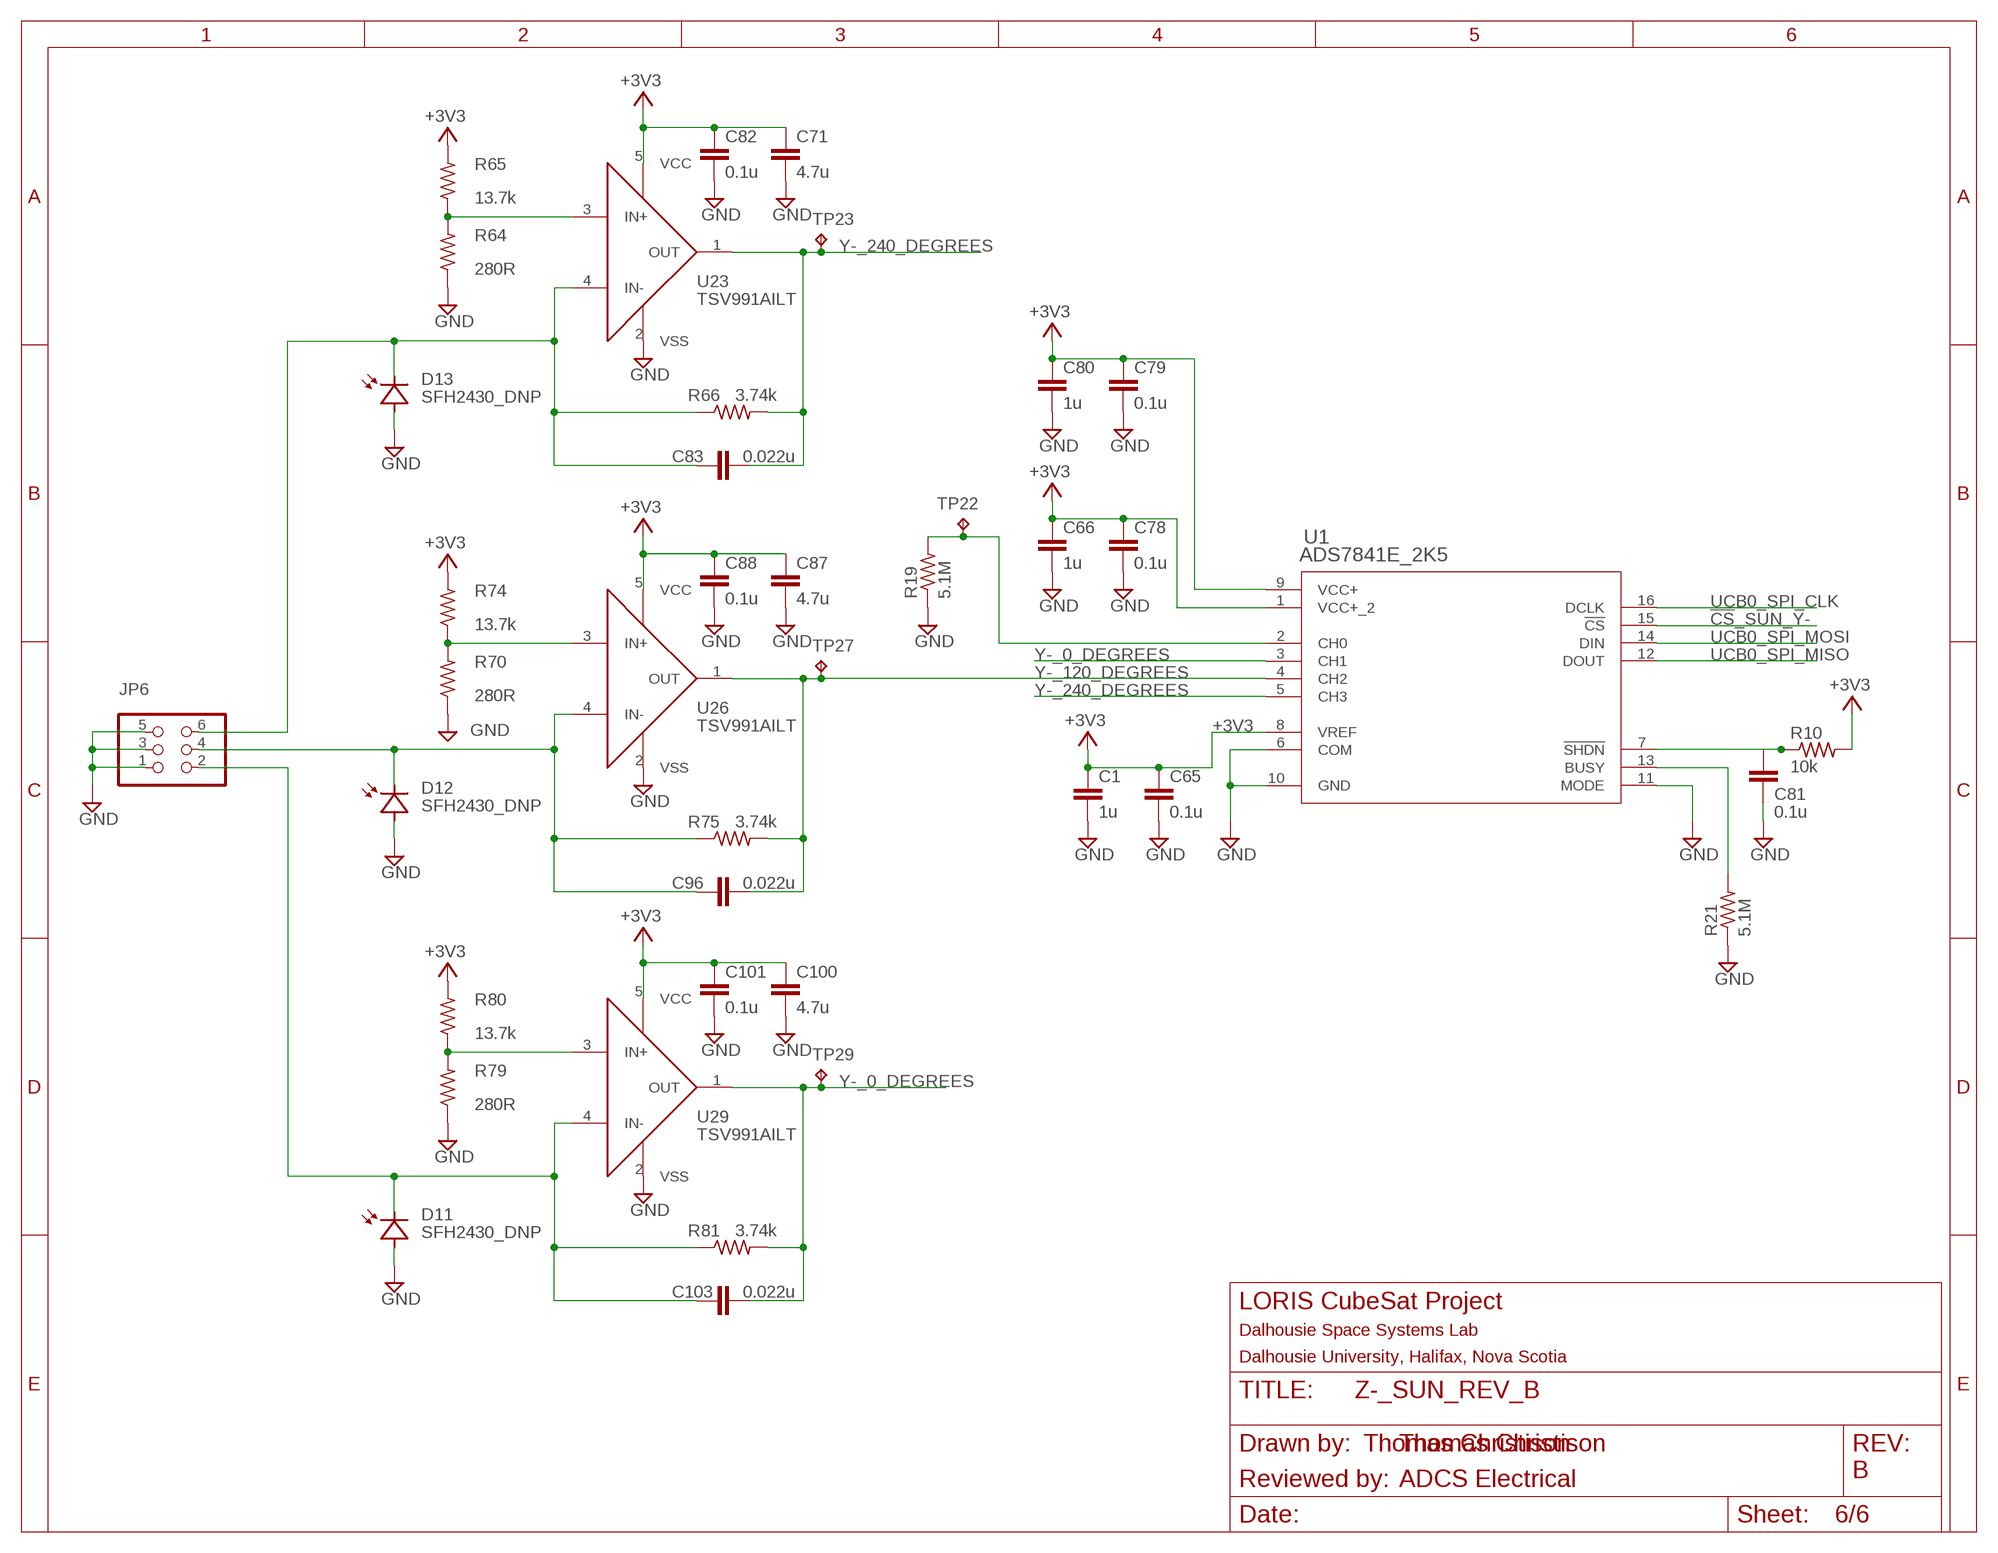
[diagram p5: schematic, sheet 6]

### Parts
C1  1u  C-EUC0402  [C0402]
C65  0.1u  C-EUC0402  [C0402]
C66  1u  C-EUC0402  [C0402]
C71  4.7u  C-EUC0805  [C0805]
C78  0.1u  C-EUC0402  [C0402]
C79  0.1u  C-EUC0402  [C0402]
C80  1u  C-EUC0402  [C0402]
C81  0.1u  C-EUC0402  [C0402]
C82  0.1u  C-EUC0402  [C0402]
C83  0.022u  C-EUC0402  [C0402]
C87  4.7u  C-EUC0805  [C0805]
C88  0.1u  C-EUC0402  [C0402]
C96  0.022u  C-EUC0402  [C0402]
C100  4.7u  C-EUC0805  [C0805]
C101  0.1u  C-EUC0402  [C0402]
C103  0.022u  C-EUC0402  [C0402]
JP6  PINHD-2X3_MTG_HOLESHOLES  [2X03_MTG_HOLES]
R10  10k  R-US_R0402  [R0402]
R19  5.1M  R-US_R0402  [R0402]
R21  5.1M  R-US_R0402  [R0402]
R64  280R  R-US_R0402  [R0402]
R65  13.7k  R-US_R0402  [R0402]
R66  3.74k  R-US_R0402  [R0402]
R70  280R  R-US_R0402  [R0402]
R74  13.7k  R-US_R0402  [R0402]
R75  3.74k  R-US_R0402  [R0402]
R79  280R  R-US_R0402  [R0402]
R80  13.7k  R-US_R0402  [R0402]
R81  3.74k  R-US_R0402  [R0402]
TP22  TESTPOINT  [TP_P76H50]
TP23  TESTPOINT  [TP_P76H50]
TP27  TESTPOINT  [TP_P76H50]
TP29  TESTPOINT  [TP_P76H50]
U1  ADS7841E_2K5  [DBQ16]
U23  TSV991AILT  [SOT95P280X145-5N]
U26  TSV991AILT  [SOT95P280X145-5N]
U29  TSV991AILT  [SOT95P280X145-5N]

### Nets
!CS!_SUN_Y-: U1.15(!CS) ; also sheet 2
+3V3: C1.1 C65.1 C66.1 C71.1 C78.1 C79.1 C80.1 C82.1 C87.1 C88.1 C100.1 C101.1 R10.2 R65.2 R74.2 R80.2 U1.1(VCC+_2) U1.8(VREF) U1.9(VCC+) U23.5(VCC) U26.5(VCC) U29.5(VCC) ; also sheet 1,2,3,4,5
GND: C1.2 C65.2 C66.2 C71.2 C78.2 C79.2 C80.2 C81.2 C82.2 C87.2 C88.2 C100.2 C101.2 JP6.1 JP6.3 JP6.5 R19.1 R21.1 R64.1 R70.1 R79.1 U1.6(COM) U1.10(GND) U1.11(MODE) U23.2(VSS) U26.2(VSS) U29.2(VSS) ; also sheet 1,2,3,4,5
N$14: R19.2 TP22.1(TP) U1.2(CH0)
N$23: C96.1 JP6.4 R75.1 U26.4(IN-)
N$24: C81.1 R10.1 U1.7(!SHDN)
N$29: C83.1 JP6.6 R66.1 U23.4(IN-)
N$35: C103.1 JP6.2 R81.1 U29.4(IN-)
N$53: R21.2 U1.13(BUSY)
N$69: R64.2 R65.1 U23.3(IN+)
N$74: R70.2 R74.1 U26.3(IN+)
N$78: R79.2 R80.1 U29.3(IN+)
UCB0_SPI_CLK: U1.16(DCLK) ; also sheet 1,2,3,4,5
UCB0_SPI_MISO: U1.12(DOUT) ; also sheet 1,2,3,4,5
UCB0_SPI_MOSI: U1.14(DIN) ; also sheet 1,2,3,4,5
Y-_0_DEGREES: C103.2 R81.2 TP29.1(TP) U1.3(CH1) U29.1(OUT)
Y-_120_DEGREES: C96.2 R75.2 TP27.1(TP) U1.4(CH2) U26.1(OUT)
Y-_240_DEGREES: C83.2 R66.2 TP23.1(TP) U1.5(CH3) U23.1(OUT)

### Notes on the sheet
- Thomas Christison
- B
- ADCS Electrical

## Library data of the parts
C1 C4 C5 C7 C8 C10 C11 C14-C22 C24 C25 C27 C28 C32 C34 C36 C37 C39 C40 C45-C53 C58 C59 C64-C67 C72-C83 C88-C96 C101-C103 = resistor:C-EU: CAPACITOR, European symbol
C2 C3 C6 C9 C12 C13 C23 C26 C29 C35 C38 C44 C57 C63 C71 C87 C100 = rcl:C-EU: CAPACITOR, European symbol; SPICEPREFIX: C
J1 = my_library:TE-1734829-2
J2 = my_library:PINHD-2X5_MTG_HOLES: PIN HEADER
J3 = my_library:HDR_1X2: JUMPER
JP2 JP4-JP6 = my_library:PINHD-2X3_MTG_HOLES: PIN HEADER
LED1 = led:LED: LED OSRAM: - CHIPLED LG R971, LG N971, LY N971, LG Q971, LY Q971, LO R971, LY R971 LH N974, LH R974 LS Q976, LO Q976, LY Q976 LO Q996 - Hyper CHIPLED LW Q18S LB Q993, LB Q99A, LB R99A - SideLED LS A670, LO A670, LY A670, LG A670, LP A670 LB A673, LV A673, LT A673, LW A673 LH A674 LY A675 LS A676, LA A676, LO A676, LY A676, LW A676 LS A679, LY A679, LG A679 - Hyper Micro SIDELED® LS Y876, LA Y876, LO Y876, LY Y876 LT Y87S - SmartLED LW L88C, LW L88S LB L89C, LB L89S, LG L890 LS L89K, LO L89K, LY L89K LS L896, LA L896, LO L896, LY L896 - TOPLED LS T670, LO T670, LY T670, LG T670, LP T670 LSG T670, LSP T670, LSY T670, LOP T670, LYG T670 LG T671, LOG T671, LSG T671 LB T673, LV T673, LT T673, LW T673 LH T674 LS T676, LA T676, LO T676, LY T676, LB T676, LH T676, LSB T676, LW T676 LB T67C, LV T67C, LT T67C, LS T67K, LO T67K, LY T67K, LW E67C LS E67B, LA E67B, LO E67B, LY E67B, LB E67C, LV E67C, LT E67C LW T67C LS T679, LY T679, LG T679 LS T770, LO T770, LY T770, LG T770, LP T770 LB T773, LV T773, LT T773, LW T773 LH T774 LS E675, LA E675, LY E675, LS T675 LS T776, LA T776, LO T776, LY T776, LB T776 LHGB T686 LT T68C, LB T68C - Hyper Mini TOPLED® LB M676 - Mini TOPLED Santana® LG M470 LS M47K, LO M47K, LY M47K Source: http://www.osram.convergy.de LUXEON: - LUMILED® LXK2-PW12-R00, LXK2-PW12-S00, LXK2-PW14-U00, LXK2-PW14-V00 LXK2-PM12-R00, LXK2-PM12-S00, LXK2-PM14-U00 LXK2-PE12-Q00, LXK2-PE12-R00, LXK2-PE12-S00, LXK2-PE14-T00, LXK2-PE14-U00 LXK2-PB12-K00, LXK2-PB12-L00, LXK2-PB12-M00, LXK2-PB14-N00, LXK2-PB14-P00, LXK2-PB14-Q00 LXK2-PR12-L00, LXK2-PR12-M00, LXK2-PR14-Q00, LXK2-PR14-R00 LXK2-PD12-Q00, LXK2-PD12-R00, LXK2-PD12-S00 LXK2-PH12-R00, LXK2-PH12-S00 LXK2-PL12-P00, LXK2-PL12-Q00, LXK2-PL12-R00 Source: www.luxeon.com KINGBRIGHT: KA-3528ASYC Source: www.kingbright.com
MH5-MH8 = my_library:MTGP700H400
R1 R3 R7-R9 R13 R20 R22-R24 R30 R32-R45 R49-R54 R58-R60 R64-R66 R70-R75 R79-R81 = resistor:R-US_: RESISTOR, American symbol
R4-R6 R10-R12 R14-R19 R21 R25-R27 = rcl:R-US_: RESISTOR, American symbol; SPICEPREFIX: R
TP1-TP6 TP9-TP11 TP13-TP17 TP19 TP21-TP25 TP27 TP29 = my_library:TESTPOINT
U1 U2 U13 U25 U27 = my_library:ADS7841E_2K5; DATASHEET_URL: http://www.ti.com/lit/gpn/ADS7841; DESCRIPTION: 12-Bit, 4-Channel Serial Output Sampling Analog-to-Digital Converter; FAMILY_NAME: PRECISION ADC (<=10MSPS); GENERIC_PART_NUMBER: ADS7841; INDUSTRY_STD_PKG_TYPE: SSOP/QSOP; MANUFACTURER: Texas Instruments; PACKAGE_DESIGNATOR: DBQ; PIN_COUNT: 16
U3 U6 U8-U12 U14 U16 U17 U19 U21 U23 U26 U29 = my_library:TSV991AILT: TVS991 General Purpose Op-Amp
U4 U5 = my_library:LM20BIM7X_NOPB
U$1 = my_library:SSR_MOUNT_03